# Altium schematic sheet 控制板.SchDoc
size A2; Author: Dolphi; DrawnBy: Dolphi; : 空调控制器继电器版; Revision: 4.0
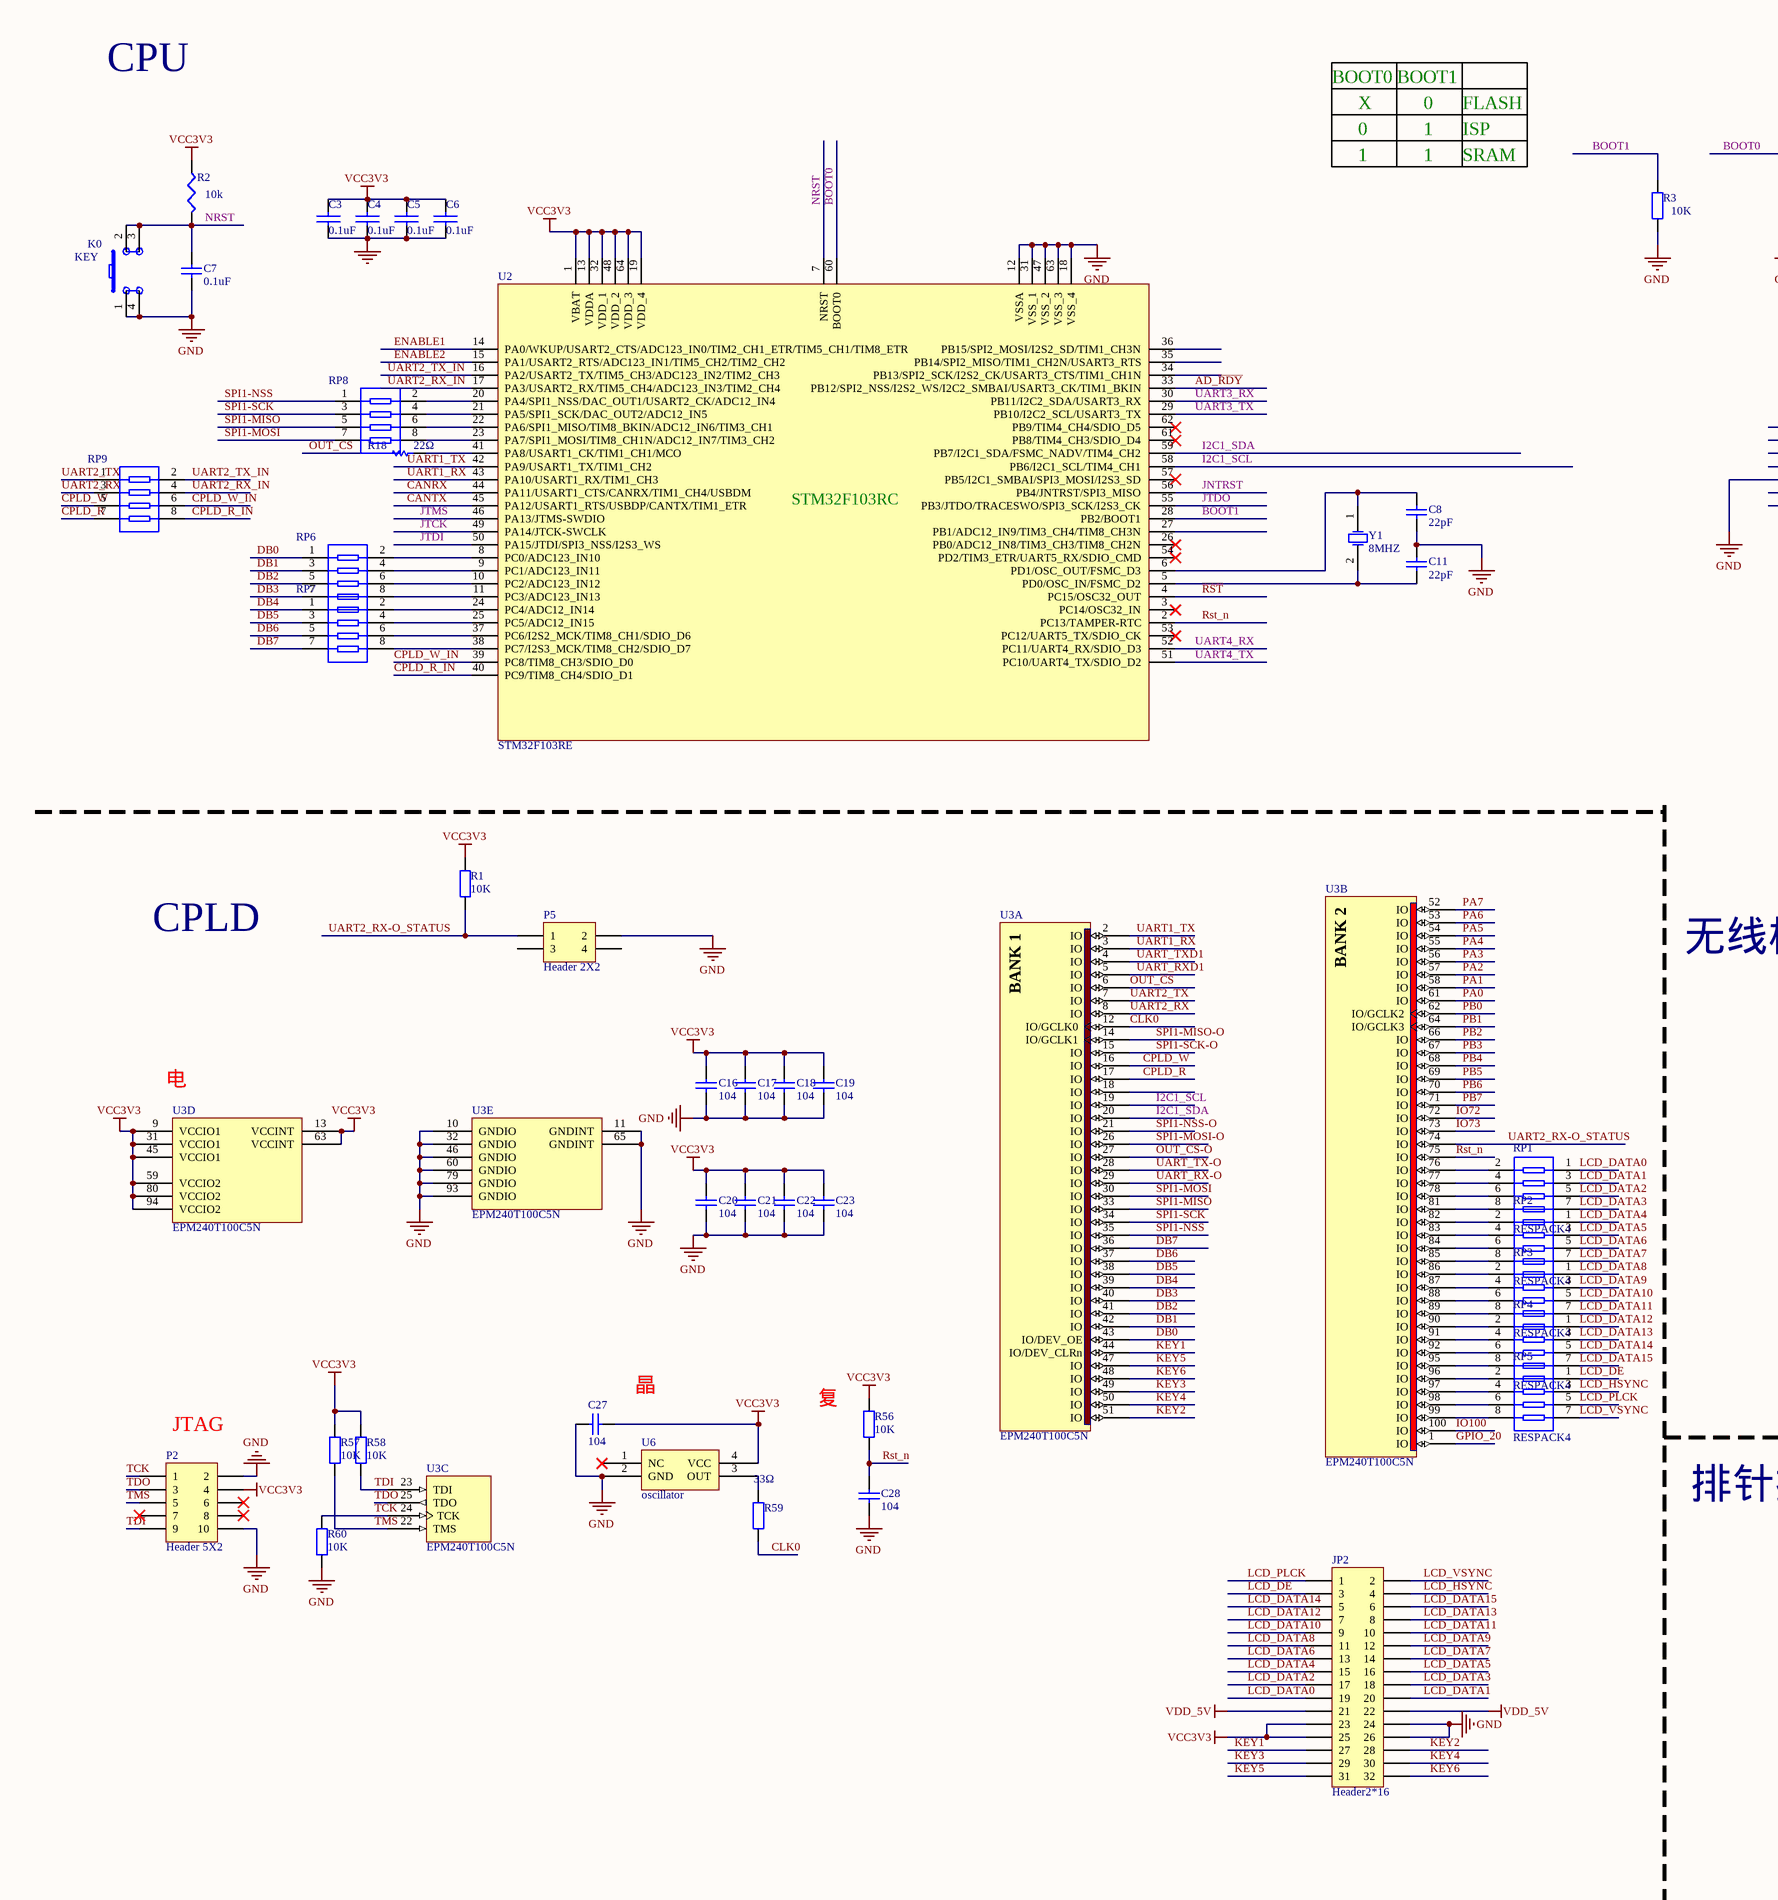
[diagram p0: 控制板.SchDoc, left]
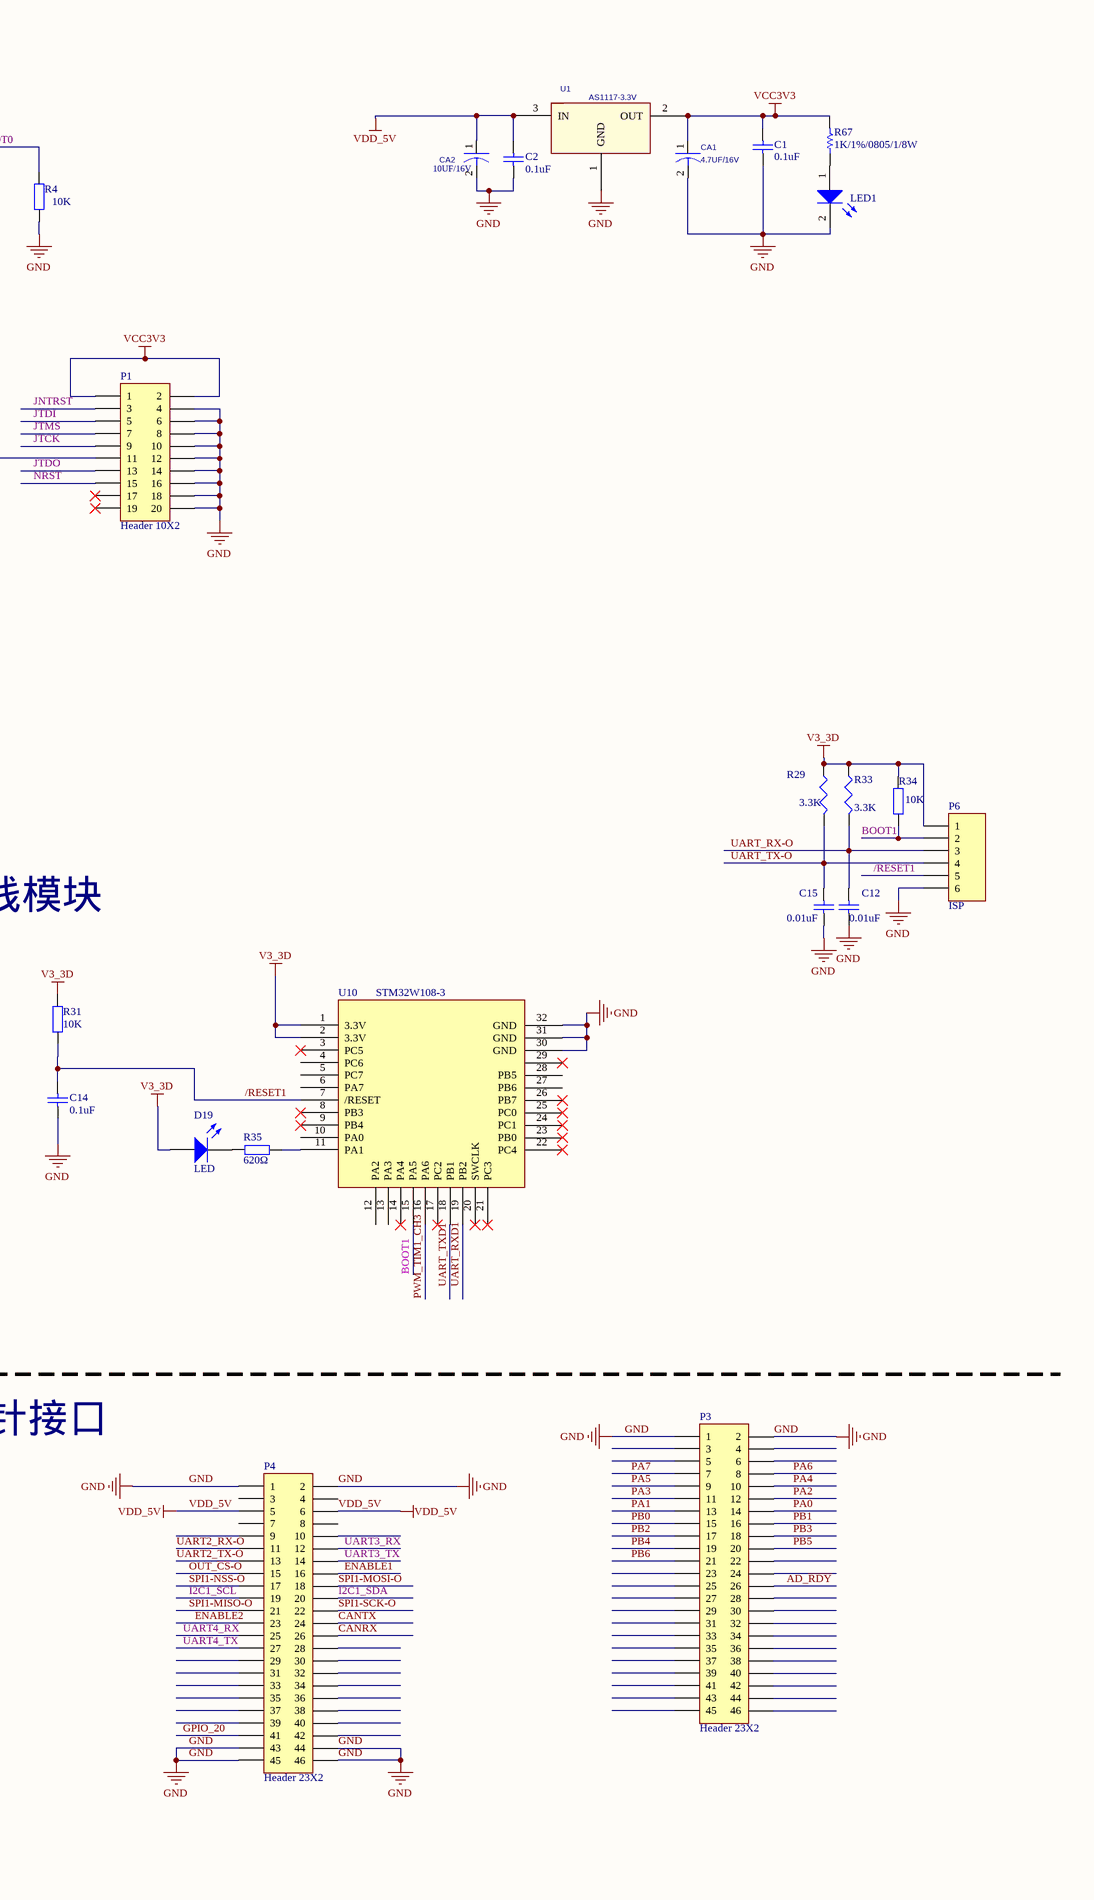
[diagram p1: 控制板.SchDoc, right]

## Parts
C1  0.1uF  [C0805]
C2  0.1uF  [C0805]
C3  0.1uF  [C0805]
C4  0.1uF  [C0805]
C5  0.1uF  [C0805]
C6  0.1uF  [C0805]
C7  0.1uF  [C0805]
C8  22pF  [C0805]
C11  22pF  [C0805]
C12  0.01uF  [C0805]
C14  0.1uF  [C0805]
C15  0.01uF  [C0805]
C16  value 104  [C0805]  (hidden comment: 0.1uF)
C17  value 104  [C0805]  (hidden comment: 0.1uF)
C18  value 104  [C0805]  (hidden comment: 0.1uF)
C19  value 104  [C0805]  (hidden comment: 0.1uF)
C20  value 104  [C0805]  (hidden comment: 0.1uF)
C21  value 104  [C0805]  (hidden comment: 0.1uF)
C22  value 104  [C0805]  (hidden comment: 0.1uF)
C23  value 104  [C0805]  (hidden comment: 0.1uF)
C27  value 104  [C0805]  (hidden comment: 0.1uF)
C28  value 104  [C0805]  (hidden comment: 0.1uF)
CA1  4.7UF/16V  [3528cap]
CA2  10UF/16V  [3528cap]
D19  LED  [0805LED]
JP2  Header2*16  [PIN-S-2.54-2*16]
K0  KEY  [KEY-DIP]
LED1  0805/Green  [LED-0805]  (value not drawn)
P1  Header 10X2  [IDC-20]
P2  Header 5X2  [IDC-10]
P3  Header 23X2  [HDR2X23]
P4  Header 23X2  [HDR2X23]
P5  Header 2X2  [SOP4]
P6  ISP  [SIP-6B]
R1  10K  [R0805]
R2  10k  [R0805]
R3  10K  [R0805]
R4  10K  [R0805]
R18  22Ω  [R0805]
R29  3.3K  [R0805]
R31  10K  [0805]
R33  3.3K  [R0805]
R34  10K  [R0805]
R35  620Ω  [R0805]
R56  10K  [R0805]
R57  10K  [R0805]
R58  10K  [R0805]
R59  33Ω  [R0805]
R60  10K  [R0805]
R67  1K/1%/0805/1/8W  [R-0805]
RP1  RESPACK4  [8P4R_0603]
RP2  RESPACK4  [8P4R_0603]
RP3  RESPACK4  [8P4R_0603]
RP4  RESPACK4  [8P4R_0603]
RP5  RESPACK4  [8P4R_0603]
RP6  RESPACK4  [8P4R_0603]  (value not drawn)
RP7  RESPACK4  [8P4R_0603]  (value not drawn)
RP8  RESPACK4  [8P4R_0603]  (value not drawn)
RP9  RESPACK4  [8P4R_0603]  (value not drawn)
U1  AS1117-3.3V  [SOT-223]
U2  STM32F103RE  [LQFP64]
U3  EPM240T100C5N  [TQFP100_N]  (parts A,B,C,D,E of 5)
U6  oscillator  [JZ-5032]
U10  STM32W108-3  [STM32W108-3]
Y1  8MHZ  [XTAL]

## Nets
GND: C1.1 C2.1 C3.2 C4.2 C5.2 C6.2 C7.1 C8.2 C11.1 C12.1 C14.1 C15.1 C16.1 C17.1 C18.1 C19.1 C20.1 C21.1 C22.1 C23.1 C27.1 C28.1 CA1.2 CA2.2 JP2.24 JP2.26 K0.1 K0.4 LED1.2(K) P1.4 P1.6 P1.8 P1.10 P1.11 P1.12 P1.14 P1.16 P1.18 P1.20 P2.2 P2.10 P3.1 P3.2 P4.1 P4.2 P4.43 P4.44 P4.45 P4.46 P5.2 P6.6 R3.1 R4.1 R60.1 U1.1(GND) U2.12(VSSA) U2.18(VSS_4) U2.31(VSS_1) U2.47(VSS_2) U2.63(VSS_3) U3.10(GNDIO) U3.11(GNDINT) U3.32(GNDIO) U3.46(GNDIO) U3.60(GNDIO) U3.65(GNDINT) U3.79(GNDIO) U3.93(GNDIO) U6.2(GND) U10.30(GND) U10.31(GND) U10.32(GND)
V3_3D: D19.1(A) P6.1 R29.1 R31.2 R33.1 R34.2 U10.1(3.3V) U10.2(3.3V)
VCC3V3: C1.2 C3.1 C4.1 C5.1 C6.1 C16.2 C17.2 C18.2 C19.2 C20.2 C21.2 C22.2 C23.2 C27.2 CA1.1 JP2.23 JP2.25 P1.1 P1.2 P2.4 R1.2 R2.1 R56.2 R57.2 R58.2 R67.2 U1.2(OUT) U2.1(VBAT) U2.13(VDDA) U2.19(VDD_4) U2.32(VDD_1) U2.48(VDD_2) U2.64(VDD_3) U3.9(VCCIO1) U3.13(VCCINT) U3.31(VCCIO1) U3.45(VCCIO1) U3.59(VCCIO2) U3.63(VCCINT) U3.80(VCCIO2) U3.94(VCCIO2) U6.4(VCC)
VDD_5V: C2.2 CA2.1 JP2.21 JP2.22 P4.5 P4.6 U1.3(IN)
/RESET1: C14.2 P6.5 R31.1 U10.7(/RESET)
AD_~{RDY}: P3.26 U2.33(PB12/SPI2_NSS/I2S2_WS/I2C2_SMBAI/USART3_CK/TIM1_BKIN)
BOOT0: R4.2 U2.60(BOOT0)
BOOT1: P6.2 R3.2 R34.1 U2.28(PB2/BOOT1) U10.15(PA5)
CANRX: P4.26 U2.44(PA11/USART1_CTS/CANRX/TIM1_CH4/USBDM)
CANTX: P4.24 U2.45(PA12/USART1_RTS/USBDP/CANTX/TIM1_ETR)
CLK0: R59.1 U3.12(IO/GCLK0)
CPLD_R: RP9.7 U3.17(IO)
CPLD_R_IN: RP9.8 U2.40(PC9/TIM8_CH4/SDIO_D1)
CPLD_W: RP9.5 U3.16(IO)
CPLD_W_IN: RP9.6 U2.39(PC8/TIM8_CH3/SDIO_D0)
DB0: RP6.1 U3.43(IO/DEV_OE)
DB1: RP6.3 U3.42(IO)
DB2: RP6.5 U3.41(IO)
DB3: RP6.7 U3.40(IO)
DB4: RP7.1 U3.39(IO)
DB5: RP7.3 U3.38(IO)
DB6: RP7.5 U3.37(IO)
DB7: RP7.7 U3.36(IO)
ENABLE1: P4.16 U2.14(PA0/WKUP/USART2_CTS/ADC123_IN0/TIM2_CH1_ETR/TIM5_CH1/TIM8_ETR)
ENABLE2: P4.23 U2.15(PA1/USART2_RTS/ADC123_IN1/TIM5_CH2/TIM2_CH2)
GPIO_20: P4.41 U3.1(IO)
I2C1_SCL: P4.19 U2.58(PB6/I2C1_SCL/TIM4_CH1) U3.19(IO)
I2C1_SDA: P4.20 U2.59(PB7/I2C1_SDA/FSMC_NADV/TIM4_CH2) U3.20(IO)
IO72: U3.72(IO)
IO73: U3.73(IO)
IO100: U3.100(IO)
JNTRST: P1.3 U2.56(PB4/JNTRST/SPI3_MISO)
JTCK: P1.9 U2.49(PA14/JTCK-SWCLK)
JTDI: P1.5 U2.50(PA15/JTDI/SPI3_NSS/I2S3_WS)
JTDO: P1.13 U2.55(PB3/JTDO/TRACESWO/SPI3_SCK/I2S3_CK)
JTMS: P1.7 U2.46(PA13/JTMS-SWDIO)
KEY1: JP2.27 U3.44(IO/DEV_CLRn)
KEY2: JP2.28 U3.51(IO)
KEY3: JP2.29 U3.49(IO)
KEY4: JP2.30 U3.50(IO)
KEY5: JP2.31 U3.47(IO)
KEY6: JP2.32 U3.48(IO)
LCD_DATA0: JP2.19 RP1.1
LCD_DATA1: JP2.20 RP1.3
LCD_DATA2: JP2.17 RP1.5
LCD_DATA3: JP2.18 RP1.7
LCD_DATA4: JP2.15 RP2.1
LCD_DATA5: JP2.16 RP2.3
LCD_DATA6: JP2.13 RP2.5
LCD_DATA7: JP2.14 RP2.7
LCD_DATA8: JP2.11 RP3.1
LCD_DATA9: JP2.12 RP3.3
LCD_DATA10: JP2.9 RP3.5
LCD_DATA11: JP2.10 RP3.7
LCD_DATA12: JP2.7 RP4.1
LCD_DATA13: JP2.8 RP4.3
LCD_DATA14: JP2.5 RP4.5
LCD_DATA15: JP2.6 RP4.7
LCD_DE: JP2.3 RP5.1
LCD_HSYNC: JP2.4 RP5.3
LCD_PLCK: JP2.1 RP5.5
LCD_VSYNC: JP2.2 RP5.7
NRST: C7.2 K0.2 K0.3 P1.15 R2.2 U2.7(NRST)
OUT_~{CS}: R18.1 U3.6(IO)
OUT_~{CS}-O: P4.15 U3.27(IO)
PA0: P3.14 U3.61(IO)
PA1: P3.13 U3.58(IO)
PA2: P3.12 U3.57(IO)
PA3: P3.11 U3.56(IO)
PA4: P3.10 U3.55(IO)
PA5: P3.9 U3.54(IO)
PA6: P3.8 U3.53(IO)
PA7: P3.7 U3.52(IO)
PB0: P3.15 U3.62(IO/GCLK2)
PB1: P3.16 U3.64(IO/GCLK3)
PB2: P3.17 U3.66(IO)
PB3: P3.18 U3.67(IO)
PB4: P3.19 U3.68(IO)
PB5: P3.20 U3.69(IO)
PB6: P3.21 U3.70(IO)
PB7: U3.71(IO)
PWM_TIM1_CH3: U10.16(PA6)
~{RST}: U2.4(PC15/OSC32_OUT)
Rst_n: C28.2 R56.1 U2.2(PC13/TAMPER-RTC) U3.75(IO)
SPI1-MISO: RP8.5 U3.33(IO)
SPI1-MISO-O: P4.21 U3.14(IO/GCLK1)
SPI1-MOSI: RP8.7 U3.30(IO)
SPI1-MOSI-O: P4.18 U3.26(IO)
SPI1-NSS: RP8.1 U3.35(IO)
SPI1-NSS-O: P4.17 U3.21(IO)
SPI1-SCK: RP8.3 U3.34(IO)
SPI1-SCK-O: P4.22 U3.15(IO)
TCK: P2.1 R60.2 U3.24(TCK)
TDI: P2.9 R58.1 U3.23(TDI)
TDO: P2.3 U3.25(TDO)
TMS: P2.5 R57.1 U3.22(TMS)
UART1_RX: U2.43(PA10/USART1_RX/TIM1_CH3) U3.3(IO)
UART1_TX: U2.42(PA9/USART1_TX/TIM1_CH2) U3.2(IO)
UART2_RX: RP9.3 U3.8(IO)
UART2_RX-O: P4.11
UART2_RX-O_STATUS: P5.1 R1.1 U3.74(IO)
UART2_RX_IN: RP9.4 U2.17(PA3/USART2_RX/TIM5_CH4/ADC123_IN3/TIM2_CH4)
UART2_TX: RP9.1 U3.7(IO)
UART2_TX-O: P4.13
UART2_TX_IN: RP9.2 U2.16(PA2/USART2_TX/TIM5_CH3/ADC123_IN2/TIM2_CH3)
UART3_RX: P4.12 U2.30(PB11/I2C2_SDA/USART3_RX)
UART3_TX: P4.14 U2.29(PB10/I2C2_SCL/USART3_TX)
UART4_RX: P4.25 U2.52(PC11/UART4_RX/SDIO_D3)
UART4_TX: P4.27 U2.51(PC10/UART4_TX/SDIO_D2)
UART_RX-O: C12.2 P6.3 R33.2 U3.29(IO)
UART_RXD1: U3.5(IO) U10.19(PB2)
UART_TX-O: C15.2 P6.4 R29.2 U3.28(IO)
UART_TXD1: U3.4(IO) U10.18(PB1)
NetC8_1: C8.1 U2.6(PD1/OSC_OUT/FSMC_D3) Y1.1(OSC1)
NetC11_2: C11.2 U2.5(PD0/OSC_IN/FSMC_D2) Y1.2(OSC2)
NetD19_2: D19.2(K) R35.2
NetLED1_1: LED1.1(A) R67.1
NetR18_2: R18.2 U2.41(PA8/USART1_CK/TIM1_CH1/MCO)
NetR35_1: R35.1 U10.11(PA1)
NetR59_2: R59.2 U6.3(OUT)
NetRP1_2: RP1.2 U3.76(IO)
NetRP1_4: RP1.4 U3.77(IO)
NetRP1_6: RP1.6 U3.78(IO)
NetRP1_8: RP1.8 U3.81(IO)
NetRP2_2: RP2.2 U3.82(IO)
NetRP2_4: RP2.4 U3.83(IO)
NetRP2_6: RP2.6 U3.84(IO)
NetRP2_8: RP2.8 U3.85(IO)
NetRP3_2: RP3.2 U3.86(IO)
NetRP3_4: RP3.4 U3.87(IO)
NetRP3_6: RP3.6 U3.88(IO)
NetRP3_8: RP3.8 U3.89(IO)
NetRP4_2: RP4.2 U3.90(IO)
NetRP4_4: RP4.4 U3.91(IO)
NetRP4_6: RP4.6 U3.92(IO)
NetRP4_8: RP4.8 U3.95(IO)
NetRP5_2: RP5.2 U3.96(IO)
NetRP5_4: RP5.4 U3.97(IO)
NetRP5_6: RP5.6 U3.98(IO)
NetRP5_8: RP5.8 U3.99(IO)
NetRP6_2: RP6.2 U2.8(PC0/ADC123_IN10)
NetRP6_4: RP6.4 U2.9(PC1/ADC123_IN11)
NetRP6_6: RP6.6 U2.10(PC2/ADC123_IN12)
NetRP6_8: RP6.8 U2.11(PC3/ADC123_IN13)
NetRP7_2: RP7.2 U2.24(PC4/ADC12_IN14)
NetRP7_4: RP7.4 U2.25(PC5/ADC12_IN15)
NetRP7_6: RP7.6 U2.37(PC6/I2S2_MCK/TIM8_CH1/SDIO_D6)
NetRP7_8: RP7.8 U2.38(PC7/I2S3_MCK/TIM8_CH2/SDIO_D7)
NetRP8_2: RP8.2 U2.20(PA4/SPI1_NSS/DAC_OUT1/USART2_CK/ADC12_IN4)
NetRP8_4: RP8.4 U2.21(PA5/SPI1_SCK/DAC_OUT2/ADC12_IN5)
NetRP8_6: RP8.6 U2.22(PA6/SPI1_MISO/TIM8_BKIN/ADC12_IN6/TIM3_CH1)
NetRP8_8: RP8.8 U2.23(PA7/SPI1_MOSI/TIM8_CH1N/ADC12_IN7/TIM3_CH2)

Not connected (* = marked no-connect by the designer): P1 17* 19*; P2 6* 7* 8*; P3 3 4 5 6 22 23 24 25 27 28 29 30 31 32 33 34 35 36 37 38 39 40 41 42 43 44 45 46; P4 3 4 7 8 9 10 28 29 30 31 32 33 34 35 36 37 38 39 40 42; P5 3 4; U2 3(PC14/OSC32_IN)* 26(PB0/ADC12_IN8/TIM3_CH3/TIM8_CH2N)* 27(PB1/ADC12_IN9/TIM3_CH4/TIM8_CH3N) 34(PB13/SPI2_SCK/I2S2_CK/USART3_CTS/TIM1_CH1N) 35(PB14/SPI2_MISO/TIM1_CH2N/USART3_RTS) 36(PB15/SPI2_MOSI/I2S2_SD/TIM1_CH3N) 53(PC12/UART5_TX/SDIO_CK)* 54(PD2/TIM3_ETR/UART5_RX/SDIO_CMD)* 57(PB5/I2C1_SMBAI/SPI3_MOSI/I2S3_SD)* 61(PB8/TIM4_CH3/SDIO_D4)* 62(PB9/TIM4_CH4/SDIO_D5)*; U3 18(IO); U6 1(NC)*; U10 3(PC5)* 4(PC6) 5(PC7) 6(PA7) 8(PB3)* 9(PB4)* 10(PA0) 12(PA2) 13(PA3) 14(PA4)* 17(PC2)* 20(SWCLK)* 21(PC3)* 22(PC4)* 23(PB0)* 24(PC1)* 25(PC0)* 26(PB7)* 27(PB6) 28(PB5) 29*

## Notes on the sheet
- CPU
- BOOT0
- X
- 0
- BOOT1
- 1
- FLASH
- ISP
- SRAM
- CPLD
- 无线模块
- (near U3) 电
- (near P2) JTAG
- 晶
- (near R56) 复
- 排针接口
- (in symbol EPM240GT100C5N, part A) BANK 1
- (in symbol EPM240GT100C5N, part B) BANK 2
- (in symbol STM32F103RE) STM32F103RC

## Library data of the parts
C1 C2 C7 C12 C14 C15 = Cap: Capacitor; Value: 100pF; Published: 8-Jun-2000; LatestRevisionDate: 17-Jul-2002; LatestRevisionNote: Re-released for DXP Platform.; Publisher: Altium Limited
  C1 C2: PackageReference: RAD-0.3; PackageDescription: Radial Cap, Thru-Hole; 2 Leads; 0.3 in Pin Spacing
C3-C6 C8 C11 C16-C23 C27 C28 = Cap: Capacitor
  C8 C11: Published: 8-Jun-2000; LatestRevisionDate: 17-Jul-2002; LatestRevisionNote: Re-released for DXP Platform.; PackageReference: RAD-0.3; Publisher: Altium Limited; Value: 22pF
  C16-C23 C27 C28: Published: 8-Jun-2000; LatestRevisionDate: 17-Jul-2002; LatestRevisionNote: Re-released for DXP Platform.; PackageReference: RAD-0.3; Publisher: Altium Limited
CA1 CA2 = ECAP
D19 = LED3: Typical BLUE SiC LED; Published: 8-Jun-2000; LatestRevisionDate: 17-Dec-2003; LatestRevisionNote: PCB Footprint replaced.; Publisher: Altium Limited
LED1 = ASD-0012AA: 名称: 发光二极管; 型号: 17-21SYGC/S530-E1 TR8; 品牌: everlight; 原编码: S-118-GX; OK?: □; Part Number: ASD-0012AA; 规格: 0805/Green
P1 = Header 10X2: Header, 10-Pin, Dual row; LatestRevisionDate: 17-Jul-2002; LatestRevisionNote: Re-released for DXP Platform.; Publisher: Altium Limited
P2 = Header 5X2: Header, 5-Pin, Dual row; LatestRevisionDate: 17-Jul-2002; LatestRevisionNote: Re-released for DXP Platform.; Publisher: Altium Limited
P3 P4 = Header 23X2: Header, 23-Pin, Dual row; LatestRevisionDate: 17-Jul-2002; LatestRevisionNote: Re-released for DXP Platform.; Publisher: Altium Limited
P5 = Header 2X2: 拨码开关; LatestRevisionDate: 17-Jul-2002; LatestRevisionNote: Re-released for DXP Platform.; Publisher: Altium Limited
P6 = Header 6: Header 6X1; LatestRevisionDate: 17-Jul-2002; LatestRevisionNote: Re-released for DXP Platform.; Publisher: Altium Limited
R1 R3 R4 R31 R34 R56-R58 R60 = Res2: Resistor; Published: 8-Jun-2000; LatestRevisionDate: 17-Jul-2002; LatestRevisionNote: Re-released for DXP Platform.; PackageReference: AXIAL-0.4; Publisher: Altium Limited; Value: 10K
R2 = Res3: Resistor; Value: 1K; Published: 8-Jun-2000; LatestRevisionDate: 17-Jul-2002; LatestRevisionNote: Re-released for DXP Platform.; Publisher: Altium Limited
R18 = Res Semi: Semiconductor Resistor; Published: 8-Jun-2000; LatestRevisionDate: 17-Jul-2002; LatestRevisionNote: Re-released for DXP Platform.; PackageReference: AXIAL-0.5; Publisher: Altium Limited; Value: 22Ω
R29 R33 = Res3: Resistor; Published: 8-Jun-2000; LatestRevisionDate: 17-Jul-2002; LatestRevisionNote: Re-released for DXP Platform.; Publisher: Altium Limited; Value: 3.3K
R35 = RES: R
R59 = Res2: Resistor; Value: 33; Published: 8-Jun-2000; LatestRevisionDate: 17-Jul-2002; LatestRevisionNote: Re-released for DXP Platform.; PackageReference: AXIAL-0.4; Publisher: Altium Limited
R67 = ASR-0028BA: Part Number: ASR-0058AA; 名称: 贴片电阻; 型号: RC0805FR-071KL; 品牌: YAGEO; 规格: 1K/1%/0805/1/8W
RP1-RP9 = RESPACK4: 22Ω
U1 = AS1117
U3 = EPM240GT100C5N: MAX II 1.8V CPLD, 80 IOs, 240 Logic Elements, 100-Pin Plastic TQFP, Commercial Temperature, Speed Grade 5, Pb-Free; Note: Each set of VCCIO pins can be connected to 3.3V, 2.5V, 1.8V, or 1.5V.; Note: All VCCINT pins must be connected to 1.8V.; Published: 4-Mar-2005; LatestRevisionDate: 13-Apr-2006; LatestRevisionNote: IPC-7351 Footprint Added.; DatasheetVersion: ver1.8, Jul-2006; PackageVersion: ver14.3, Jul-2006; PackageReference: TQFP100; Publisher: Altium Limited; PackageDescription: 100-Pin Plastic Thin Quad Flat Pack (TQFP100); Code_JEDEC: MS-026-AED; ComponentLink1Description: Manufacturer Link; ComponentLink1URL: http://www.altera.com/products/devices/cpld/max2/mx2-index.jsp; ComponentLink2Description: Handbook; ComponentLink2URL: http://www.altera.com/literature/hb/max2/max2_mii5v1.pdf; ComponentLink3Description: Packaging Specification; ComponentLink3URL: http://www.altera.com/literature/ds/dspkg.pdf
Y1 = XTAL: Crystal Oscillator; Published: 8-Jun-2000; LatestRevisionDate: 17-Jul-2002; LatestRevisionNote: Re-released for DXP Platform.; PackageReference: R38; Publisher: Altium Limited